# Altium schematic sheet USB-I2C.SchDoc
size A4
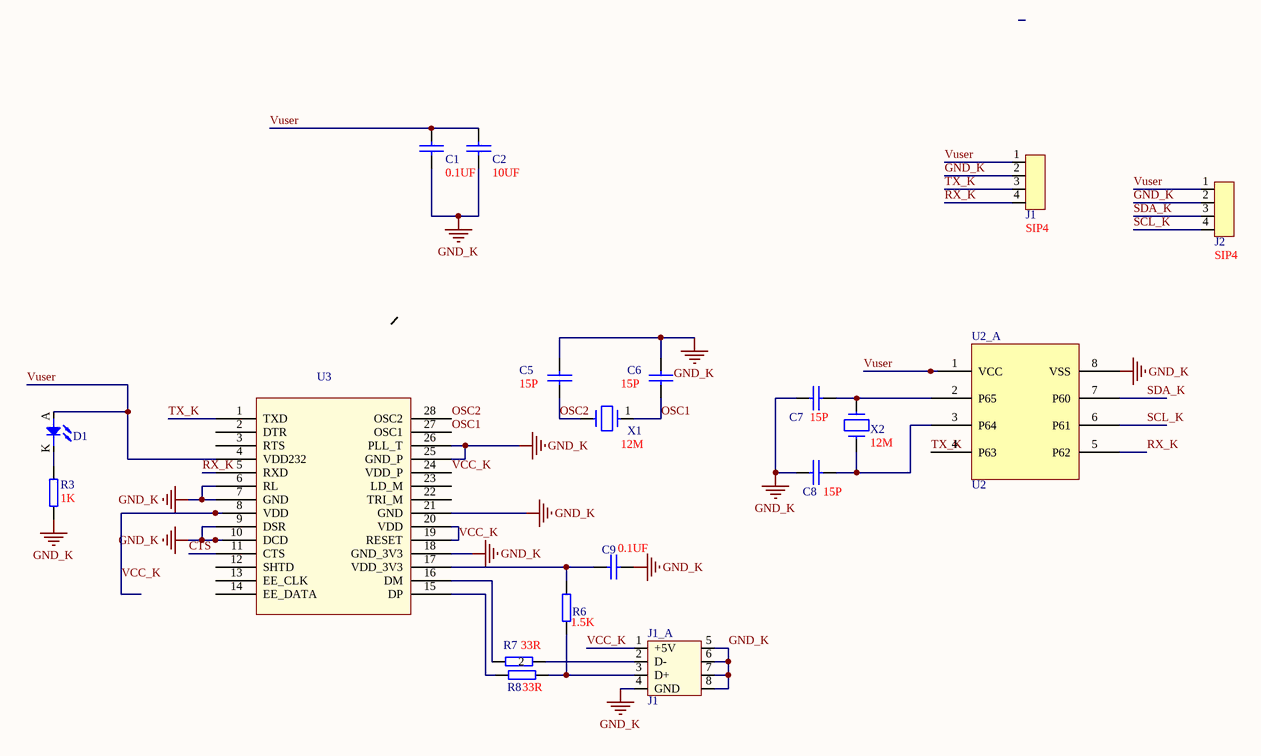
[diagram p0: USB-I2C.SchDoc]

## Parts
(Parts that share a designator on the sheet are numbered #1, #2 ... from top to bottom, then left to right.)
C1_A  C1  value 0.1UF  [0603-my]
C2_A  C2  value 10UF  [0603-my]
C5_A  C5  value 15P  [0603-my]
C6_A  C6  value 15P  [0603-my]
C7_A  C7  value 15P  [0603-my]
C8_A  C8  value 15P  [0603-my]
C9_A  C9  value 0.1UF  [0603-my]
D1_A  D1  [LED3]
J1_A#1  J1  value SIP4  [SIP-4-2.54]
J1_A#2  J1  [USB-MAIE-A-DIP]
J2_A  J2  value SIP4  [SIP-4-2.54]
R3_A  R3  value 1K  [0603-my]
R6_A  R6  value 1.5K  [0603-my]
R7_A  R7  value 33R  [0603-my]
R8_A  R8  value 33R  [0603-my]
U2_A  U2  [SO-8]
U3_A  U3  [SSOP-28]
X1_A  X1  value 12M  [XTAL-2]
X2_A  X2  value 12M  [XTAL-2]

## Nets
GND_K: C1_A.2 C2_A.2 C5_A.1 C6_A.1 C7_A.1 C8_A.1 C9_A.2 J1_A#1.2 J1_A#2.4(GND) J1_A#2.5 J1_A#2.6 J1_A#2.7 J1_A#2.8 J2_A.2 R3_A.2 U2_A.8(VSS) U3_A.6(RL) U3_A.7(GND) U3_A.9(DSR) U3_A.10(DCD) U3_A.18(GND_3V3) U3_A.21(GND) U3_A.25(GND_P) U3_A.26(PLL_T)
CTS: U3_A.11(CTS)
OSC1: C6_A.2 U3_A.27(OSC1) X1_A.1
OSC2: C5_A.2 U3_A.28(OSC2) X1_A.2
RX_K: J1_A#1.4 U2_A.5(P62) U3_A.5(RXD)
SCL_K: J2_A.4 U2_A.6(P61)
SDA_K: J2_A.3 U2_A.7(P60)
TX_K: J1_A#1.3 U2_A.4(P63) U3_A.1(TXD)
VCC_K: J1_A#2.1(+5V) U3_A.8(VDD) U3_A.19(RESET) U3_A.20(VDD) U3_A.24(VDD_P)
Vuser: C1_A.1 C2_A.1 D1_A.A J1_A#1.1 J2_A.1 U2_A.1(VCC) U3_A.4(VDD232)
NetC7_A_2: C7_A.2 U2_A.2(P65) X2_A.2
NetC8_A_2: C8_A.2 U2_A.3(P64) X2_A.1
NetC9_A_1: C9_A.1 R6_A.1 U3_A.17(VDD_3V3)
NetD1_A_K: D1_A.K R3_A.1
NetJ1_A#2_2: J1_A#2.2(D-) R7_A.2
NetJ1_A#2_3: J1_A#2.3(D+) R6_A.2 R8_A.2
NetR7_A_1: R7_A.1 U3_A.16(DM)
NetR8_A_1: R8_A.1 U3_A.15(DP)

Not connected (* = marked no-connect by the designer): U3_A 2(DTR) 3(RTS) 12(SHTD) 13(EE_CLK) 14(EE_DATA) 22(TRI_M) 23(LD_M)

## Library data of the parts
C1_A C2_A C5_A C6_A C7_A C8_A C9_A = CAP
D1_A = B_LED
J1_A#1 J2_A = SIP-4
J1_A#2 = USB-A1
R3_A R6_A R7_A R8_A = RES
U2_A = EM78P153SO8
U3_A = PL2303HX
X1_A X2_A = CRYSTAL_2